# EAGLE design dx10lm1-14se-to-ml-14p (EAGLE 9.1.0)
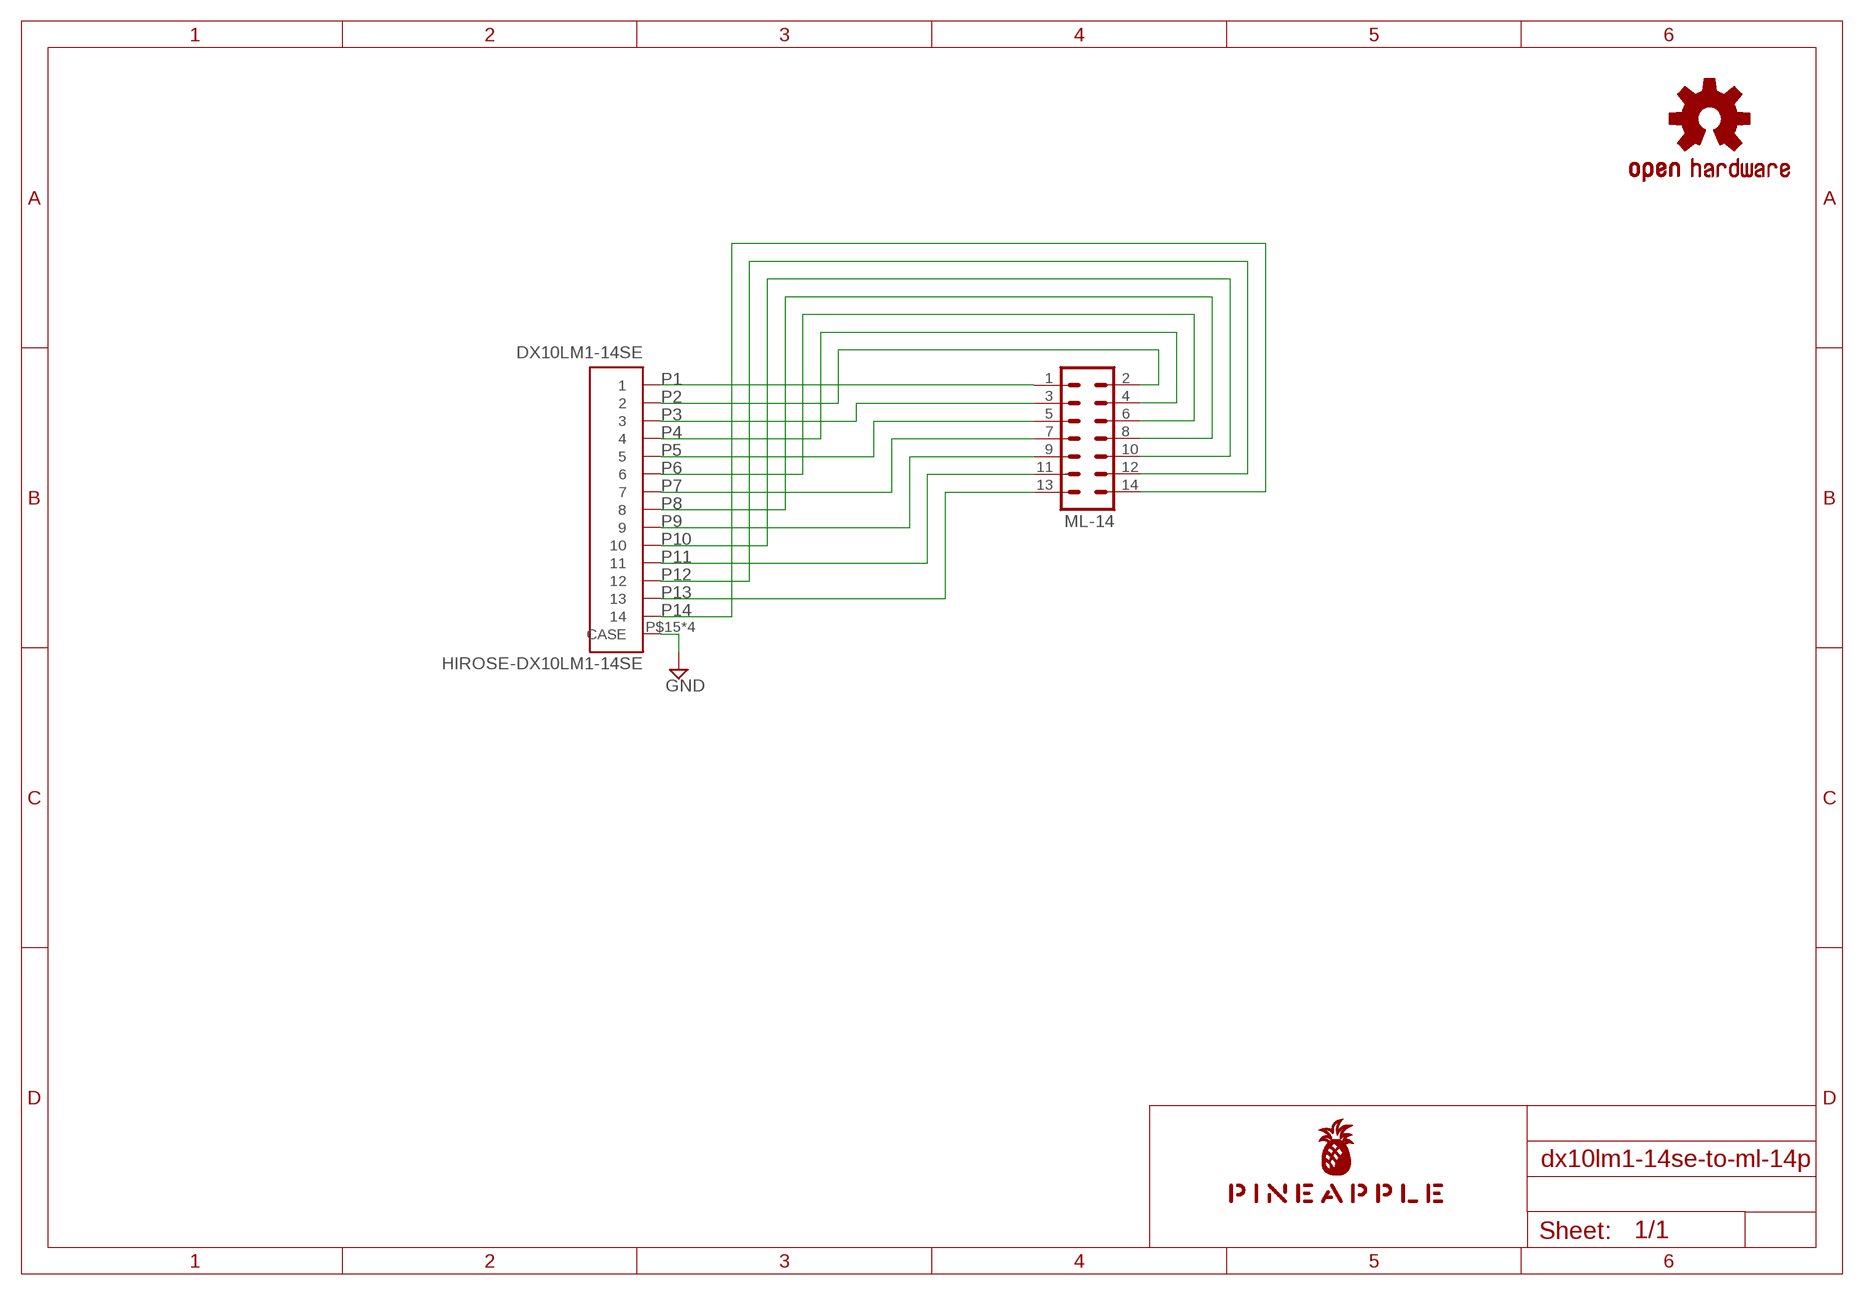
[diagram p0: schematic, sheet 1]

## Parts
DX10LM1-14SE  HIROSE-DX10LM1-14SE  [HIROSE-DX10LM1-14SE]
LOGO1  OSHW-LOGOS-COPPER  [OSHW-LOGO-S_COPPER]
ML-14  ML14L  [ML14L]
U$1  PINEAPPLE450_SILK  [PINEAPPLE450_SILK]

## Nets
GND: DX10LM1-14SE.P$15(CASE) DX10LM1-14SE.P$16(CASE) DX10LM1-14SE.P$17(CASE) DX10LM1-14SE.P$18(CASE)
P1: DX10LM1-14SE.P$1 ML-14.1
P2: DX10LM1-14SE.P$2 ML-14.2
P3: DX10LM1-14SE.P$3 ML-14.3
P4: DX10LM1-14SE.P$4 ML-14.4
P5: DX10LM1-14SE.P$5 ML-14.5
P6: DX10LM1-14SE.P$6 ML-14.6
P7: DX10LM1-14SE.P$7 ML-14.7
P8: DX10LM1-14SE.P$8 ML-14.8
P9: DX10LM1-14SE.P$9 ML-14.9
P10: DX10LM1-14SE.P$10 ML-14.10
P11: DX10LM1-14SE.P$11 ML-14.11
P12: DX10LM1-14SE.P$12 ML-14.12
P13: DX10LM1-14SE.P$13 ML-14.13
P14: DX10LM1-14SE.P$14 ML-14.14

## Library data of the parts
DX10LM1-14SE = con-hirose-dx10lm1-14se:HIROSE-DX10LM1-14SE: HIROSE DX10LM1-14SE
LOGO1 = SparkFun-Aesthetics:OSHW-LOGO: Open-Source Hardware (OSHW) Logo This logo indicates the piece of hardware it is found on incorporates a OSHW license and/or adheres to the definition of open source hardware found here: http://freedomdefined.org/OSHW
ML-14 = con-ml:ML14L: HARTING; OC_FARNELL: unknown; OC_NEWARK: unknown
U$1 = pineapple:PINEAPPLE450_SILK

## Net classes
0 default: width 0.61 mm, drill 0.152 mm, clearance 0.152 mm

## Board
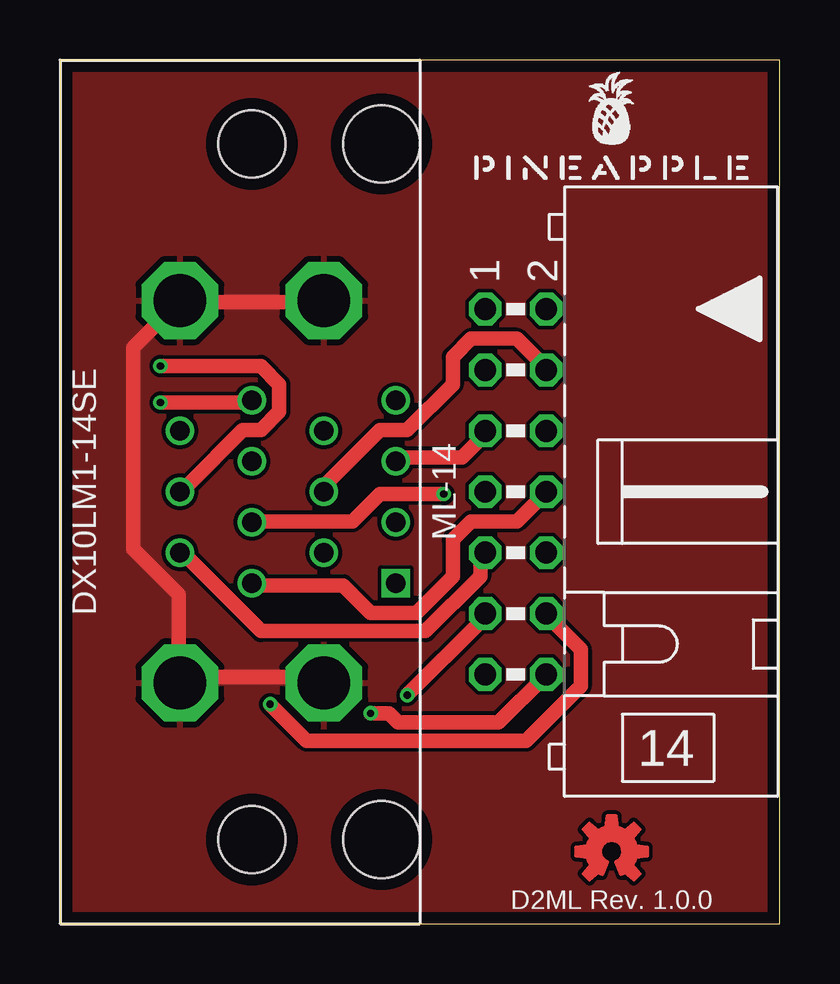
[diagram p1: board, top side]
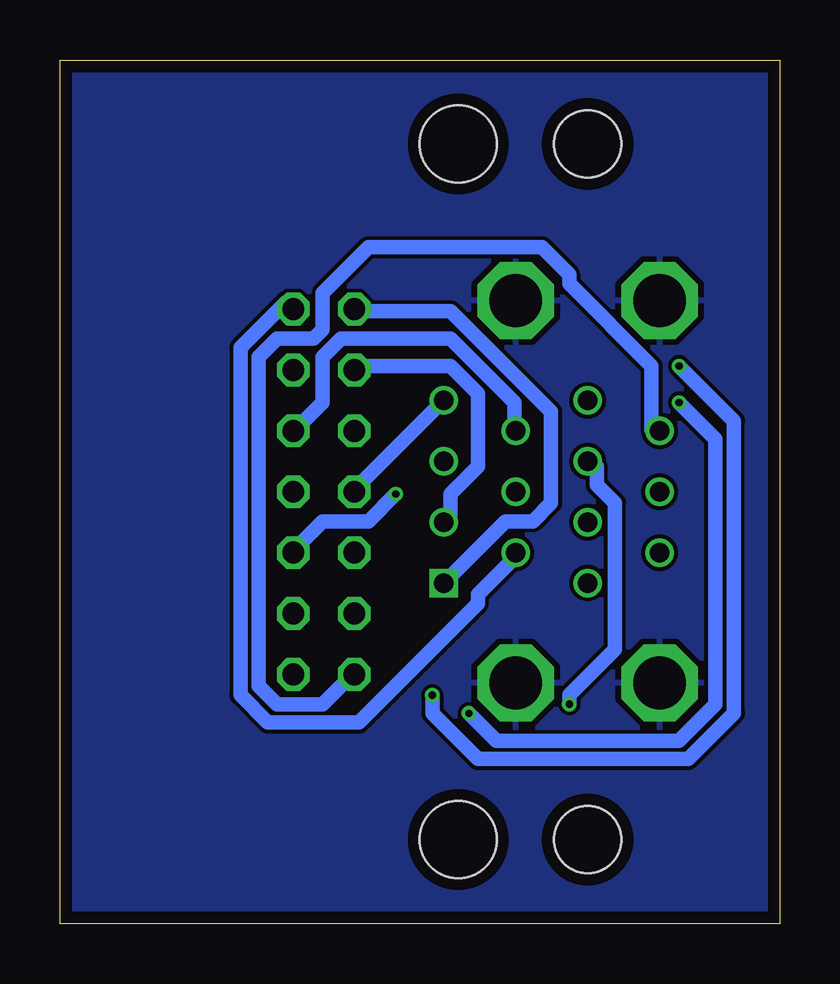
[diagram p2: board, bottom side, seen from below]

Size 30 x 36 mm. Coordinates in mm from the lower left corner, seen from the top.
Outline: 0,0 30,0 30,36 0,36 0,0
Copper layers (1*16): Top 0.035mm / dielectric 1.53mm / Bottom 0.035mm
Design rules "pban_5mil-l2": minimum track width 5mil, minimum drill 0.3mm, track to track 5mil, track to pad 0.229mm, pad to pad 5mil, via to via 5mil, smd to smd 5mil, copper to edge 0.5mm, drill to drill 0.5mm, minimum pad ring 0.15mm, minimum via ring 0.15mm, stop-mask expansion 4mil, vias tented up to drill 0.35mm, thermal gap 10mil

### Footprints (pad centres in the part's own frame; a part is rotated, then mirrored left to right if it is on the bottom)
HIROSE-DX10LM1-14SE = drill 0.8 square: P$1 3.81,9 | drill 0.8: P$2 2.54,6; P$3 1.27,9; P$4 0,6; P$5 -1.27,9; P$6 -2.54,6; P$7 -3.81,9; P$8 3.81,3; P$9 2.54,0; P$10 1.27,3; P$11 0,0; P$12 -1.27,3; P$13 -2.54,0; P$14 -3.81,3 | drill 2.2 octagon: P$15 -7.97,0; P$16 7.97,0; P$17 7.97,6; P$18 -7.97,6 | hole 2.8: -14.5,3; 14.5,3 | hole 3.2: -14.5,8.4; 14.5,8.4
ML14L = drill 0.914 octagon: 1 -7.62,-1.27; 2 -7.62,1.27; 3 -5.08,-1.27; 4 -5.08,1.27; 5 -2.54,-1.27; 6 -2.54,1.27; 7 0,-1.27; 8 0,1.27; 9 2.54,-1.27; 10 2.54,1.27; 11 5.08,-1.27; 12 5.08,1.27; 13 7.62,-1.27; 14 7.62,1.27

### Placement (x,y rotation side)
DX10LM1-14SE  5,18 270 top
LOGO1  23,3 0 top
ML-14  19,18 270 top
U$1  23,31 0 top

### Tracks (layer width: path | path; a pad name or v marks a point on that pad's centre or on a via)
GND
  Top 0.61: DX10LM1-14SE.P$17 10.67,10.29 5.33,10.29 DX10LM1-14SE.P$16 4.95,10.29 4.95,13.72 3.05,15.62 3.05,24 4.95,25.91 DX10LM1-14SE.P$15 5.33,25.91 10.67,25.91 DX10LM1-14SE.P$18
  pour Top: -1,-1 31,-1 31,37 -1,37
  pour Bottom: -2,-2 32,-2 32,38 -2,38
P1
  Bottom 0.61: DX10LM1-14SE.P$1 13.72,14.48 11.43,16.76 10.29,16.76 9.53,17.53 9.53,21.34 13.72,25.53 17.53,25.53 ML-14.1
P2
  Bottom 0.61: DX10LM1-14SE.P$2 11.05,15.24 12.57,13.72 12.57,13.34 17.53,8.38 21.34,8.38 22.48,9.53 22.48,24 20.57,25.91 ML-14.2
P3
  Bottom 0.61: DX10LM1-14SE.P$3 13.72,16.76 13.72,17.91 12.57,19.05 12.57,22.1 13.72,23.24 17.53,23.24 ML-14.3
P4
  Top 0.61: DX10LM1-14SE.P$4 11.05,18.29 13.34,20.57 14.48,20.57 16.38,22.48 16.38,23.62 17.14,24.38 19.05,24.38 20.19,23.24 ML-14.4
P5
  Top 0.61: DX10LM1-14SE.P$5 14.1,19.43 16.76,19.43 17.53,20.19 ML-14.5
P6
  Bottom 0.61: DX10LM1-14SE.P$6 11.05,20.57 11.05,21.72 13.72,24.38 18.29,24.38 19.05,23.62 19.05,21.72 20.19,20.57 ML-14.6
P7
  Bottom 0.61: DX10LM1-14SE.P$7 14.1,21.72 17.53,18.29 ML-14.7
P8
  Top 0.61: DX10LM1-14SE.P$8 8,14.1 11.81,14.1 12.95,12.95 14.86,12.95 16.38,14.48 16.38,16 17.14,16.76 19.05,16.76 20.19,17.91 ML-14.8
P9
  Top 0.61: DX10LM1-14SE.P$9 5.33,15.24 8.38,12.19 15.24,12.19 17.53,14.48 17.53,15.24 ML-14.9
P10  (via drill 0.3)
  Top 0.61: v16,17.91 13.34,17.91 12.19,16.76 8,16.76 DX10LM1-14SE.P$10
  Bottom 0.61: v16,17.91 17.14,16.76 19.05,16.76 20.19,15.62 ML-14.10
P11  (via drill 0.3)
  Top 0.61: v4.19,23.24 8.38,23.24 9.14,22.48 9.14,21.34 8.38,20.57 7.62,20.57 5.33,18.29 DX10LM1-14SE.P$11 | v14.48,9.53 17.53,12.57 ML-14.11
  Bottom 0.61: v4.19,23.24 1.91,20.95 1.91,8.76 3.81,6.86 12.57,6.86 14.48,8.76 v14.48,9.53
P12  (via drill 0.3)
  Top 0.61: v8.76,9.14 10.29,7.62 19.43,7.62 21.72,9.91 21.72,11.43 20.57,12.57 ML-14.12
  Bottom 0.61: v8.76,9.14 8.76,9.53 6.86,11.43 6.86,17.53 7.62,18.29 7.62,19.05 DX10LM1-14SE.P$12
P13
  Bottom 0.61: DX10LM1-14SE.P$13 5.33,20.57 5.33,23.24 8.76,26.67 8.76,27.05 9.91,28.19 17.14,28.19 19.05,26.29 19.05,24.77 19.43,24.38 20.95,24.38 21.72,23.62 21.72,9.91 20.95,9.14 19.05,9.14 17.91,10.29 ML-14.13
P14  (via drill 0.3)
  Top 0.61: v4.19,21.72 7.62,21.72 DX10LM1-14SE.P$14 | v12.95,8.76 13.72,8.76 14.1,8.38 18.29,8.38 20.19,10.29 ML-14.14
  Bottom 0.61: v4.19,21.72 2.67,20.19 2.67,9.14 4.19,7.62 11.81,7.62 v12.95,8.76

### Text on the board
tNames: D2ML Rev. 1.0.0